# EAGLE design atmega328pTest (EAGLE 9.5.0)
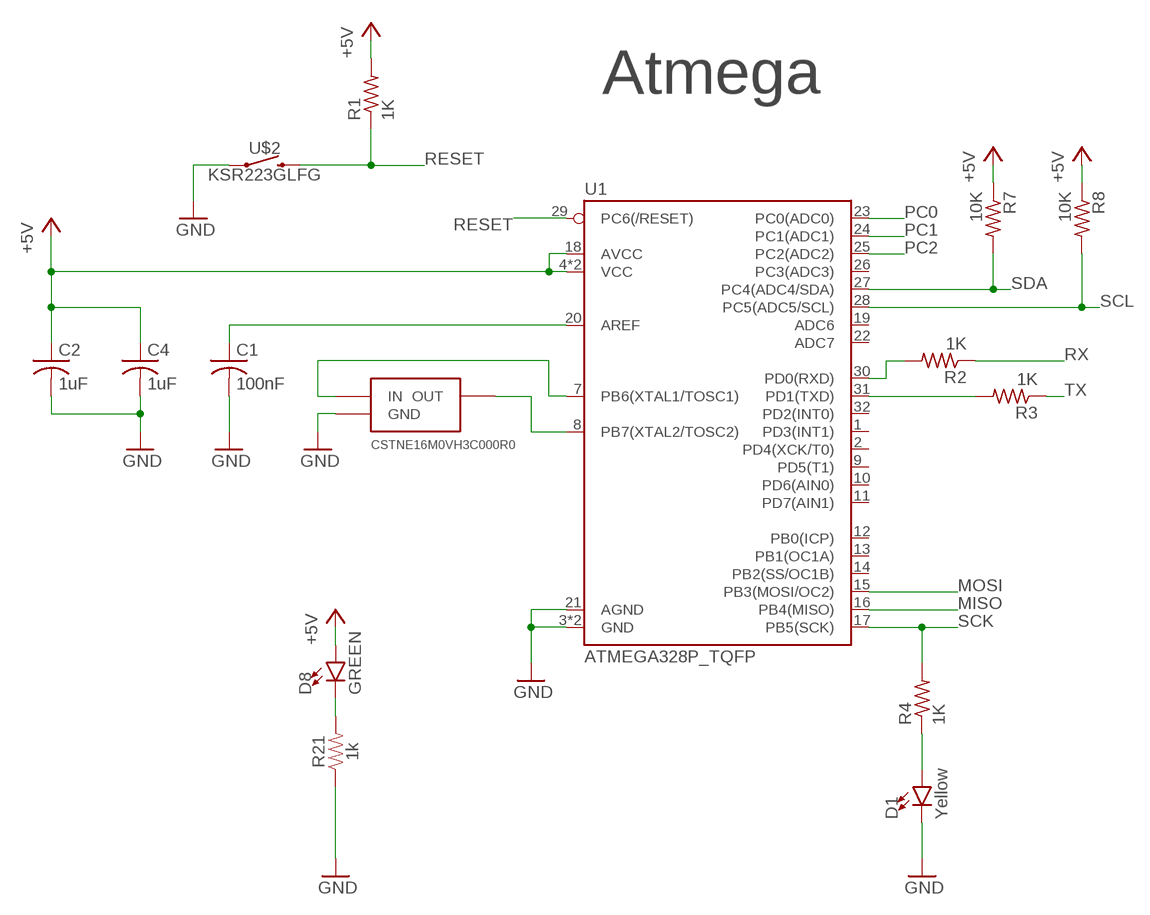
[diagram p0: schematic, sheet 1, part 1 of 2]
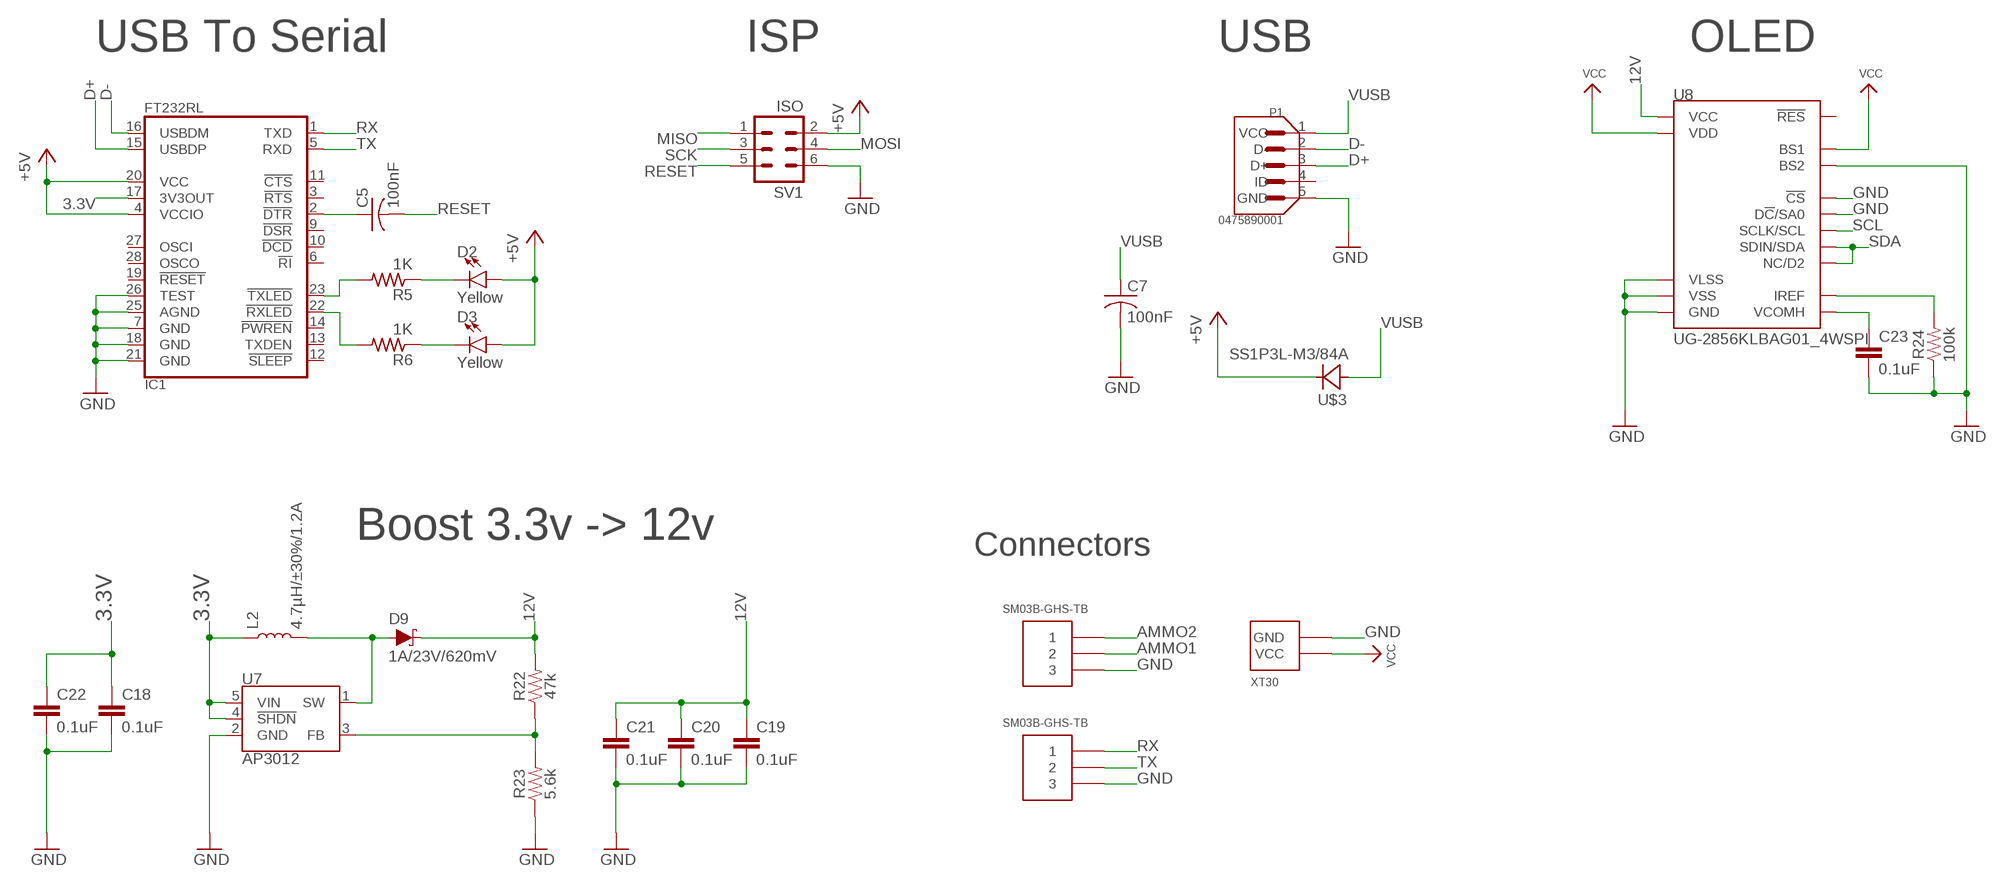
[diagram p1: schematic, sheet 1, part 2 of 2]

## Parts
C1  100nF  C-USC0603  [C0603]
C2  1uF  C-USC0603  [C0603]
C4  1uF  C-USC0603  [C0603]
C5  100nF  C-USC0603  [C0603]
C7  100nF  C-USC0603  [C0603]
C18  0.1uF  0.1UF-0603-25V-(+80/-20%)  [0603]
C19  0.1uF  0.1UF-0603-25V-(+80/-20%)  [0603]
C20  0.1uF  0.1UF-0603-25V-(+80/-20%)  [0603]
C21  0.1uF  0.1UF-0603-25V-(+80/-20%)  [0603]
C22  0.1uF  0.1UF-0603-25V-(+80/-20%)  [0603]
C23  0.1uF  0.1UF-0603-25V-(+80/-20%)  [0603]
D1  Yellow  LED0603  [LED-0603]
D2  Yellow  LED0603  [LED-0603]
D3  Yellow  LED0603  [LED-0603]
D8  GREEN  LED0603  [LED-0603]
D9  1A/23V/620mV  DIODE-SCHOTTKY-BAT20J  [SOD-323]
IC1  FT232RL  [SSOP28-LD]
L2  4.7µH/±30%/1.2A  INDUCTOR-CDRH-4.7UH  [INDUCTOR_4.7UH]
P1  0475890001  [MOLEX_0475890001]
R1  1K  R-US_R0603  [R0603]
R2  1K  R-US_R0603  [R0603]
R3  1K  R-US_R0603  [R0603]
R4  1K  R-US_R0603  [R0603]
R5  1K  R-US_R0603  [R0603]
R6  1K  R-US_R0603  [R0603]
R7  10K  R-US_R0603  [R0603]
R8  10K  R-US_R0603  [R0603]
R21  1k  1KOHM-0603-1/10W-1%  [0603]
R22  47k  47KOHM-0603-1/10W-1%  [0603]
R23  5.6k  5.6KOHM-0603-1/10W-1%  [0603]
R24  100k  100KOHM-0603-1/10W-1%  [0603]
SV1  ISO  MA03-2  [MA03-2]
U1  ATMEGA328P_TQFP  [TQFP32-08]
U7  AP3012  [SOT23-5]
U8  UG-2856KLBAG01_4WSPI  [FPC05024-42201]
U$1  CSTNE16M0VH3C000R0  [CSTNE16M0VH3C000R0]
U$2  KSR223GLFG  [KSR223GLFG]
U$3  SS1P3L-M3/84A  [SS1P3L-M3/84A]
U$13  SM03B-GHS-TB  [SM03B-GHS-TB]
U$14  SM03B-GHS-TB  [SM03B-GHS-TB]
U$15  XT30PW-M  [XT30]

## Nets
3.3V: C18.1 C22.1 IC1.17(3V3OUT) L2.P$1 U7.4(!SHDN!) U7.5(VIN)
12V: C19.1 C20.1 C21.1 D9.C R22.2 U8.P$23(VCC)
+5V: C2.1 C4.1 D2.A D3.A D8.A IC1.4(VCCIO) IC1.20(VCC) R1.2 R7.1 R8.1 SV1.2 U1.4(VCC) U1.6(VCC) U1.18(AVCC) U$3.P$1(C)
AMMO1: U$14.P$4
AMMO2: U$14.P$3
D+: IC1.15(USBDP) P1.3(D+)
D-: IC1.16(USBDM) P1.2(D-)
GND: C1.2 C2.2 C4.2 C7.2 C18.2 C19.2 C20.2 C21.2 C22.2 C23.2 D1.C IC1.7(GND) IC1.18(GND) IC1.21(GND) IC1.25(AGND) IC1.26(TEST) P1.5(GND) R21.1 R23.1 R24.1 SV1.6 U1.3(GND) U1.5(GND) U1.21(AGND) U7.2(GND) U8.P$1(GND) U8.P$2(VLSS) U8.P$3(VSS) U8.P$7(BS2) U8.P$8(!CS) U8.P$10(D!C!/SA0) U8.P$11(GND) U8.P$12(GND) U8.P$16(GND) U8.P$17(GND) U8.P$18(GND) U8.P$19(GND) U8.P$20(GND) U8.P$24(GND) U$1.2(GND) U$2.P$1 U$13.P$5 U$14.P$5 U$15.P$2(GND)
MISO: SV1.1 U1.16(PB4(MISO))
MOSI: SV1.4 U1.15(PB3(MOSI/OC2))
N$1: U1.7(PB6(XTAL1/TOSC1)) U$1.1(IN)
N$2: U1.8(PB7(XTAL2/TOSC2)) U$1.3(OUT)
N$3: D1.A R4.1
N$4: C1.1 U1.20(AREF)
N$5: IC1.23(!TXLED) R5.2
N$6: IC1.22(!RXLED) R6.2
N$7: C5.1 IC1.2(!DTR)
N$8: R2.2 U1.30(PD0(RXD))
N$9: R3.2 U1.31(PD1(TXD))
N$10: D2.C R5.1
N$11: D3.C R6.1
N$27: D8.C R21.2
N$28: D9.A L2.P$2 U7.1(SW)
N$29: R22.1 R23.2 U7.3(FB)
N$30: C23.1 U8.P$22(VCOMH)
N$31: R24.2 U8.P$21(IREF)
PC0: U1.23(PC0(ADC0))
PC1: U1.24(PC1(ADC1))
PC2: U1.25(PC2(ADC2))
RESET: C5.2 R1.1 SV1.5 U1.29(PC6(/RESET)) U$2.P$2
RX: IC1.1(TXD) R2.1 U$13.P$3
SCK: R4.2 SV1.3 U1.17(PB5(SCK))
SCL: R8.2 U1.28(PC5(ADC5/SCL)) U8.P$13(SCLK/SCL)
SDA: R7.2 U1.27(PC4(ADC4/SDA)) U8.P$14(SDIN/SDA) U8.P$15(NC/D2)
TX: IC1.5(RXD) R3.1 U$13.P$4
VCC: U8.P$5(VDD) U8.P$6(BS1) U$15.P$1(VCC)
VUSB: C7.1 P1.1(VCC) U$3.P$2(A)
Unconnected: IC1.3(!RTS) IC1.6(!RI) IC1.9(!DSR) IC1.10(!DCD) IC1.11(!CTS) IC1.12(!SLEEP) IC1.13(TXDEN) IC1.14(!PWREN) IC1.19(!RESET) IC1.27(OSCI) IC1.28(OSCO) P1.4(ID) U1.1(PD3(INT1)) U1.2(PD4(XCK/T0)) U1.9(PD5(T1)) U1.10(PD6(AIN0)) U1.11(PD7(AIN1)) U1.12(PB0(ICP)) U1.13(PB1(OC1A)) U1.14(PB2(SS/OC1B)) U1.19(ADC6) U1.22(ADC7) U1.26(PC3(ADC3)) U1.32(PD2(INT0)) U8.P$9(!RES)

## Notes on the sheet
- Atmega
- USB To Serial | ISP | USB | OLED
- Boost 3.3v -> 12v
- Connectors

## Library data of the parts
C1 C2 C4 C5 C7 = rcl:C-US: CAPACITOR, American symbol; SPICEPREFIX: C
C18-C23 = SparkFun-Capacitors:0.1UF: 0.1µF ceramic capacitors A capacitor is a passive two-terminal electrical component used to store electrical energy temporarily in an electric field.; PROD_ID: CAP-00810
D1-D3 D8 = SparkFun-LED:LED: LED (Generic) Standard schematic elements and footprints for 5mm, 3mm, 1206, and 0603 sized LEDs. Generic LEDs with no color specified.
D9 = SparkFun-DiscreteSemi:DIODE-SCHOTTKY: Schottky diode A Schottky diode is a semiconductor diode which has a low forward voltage drop and a very fast switching action.; PROD_ID: DIO-11623
IC1 = FT232RL:FT232RL; DESCRIPTION: USB Bridge, USB to UART USB 2.0 UART Interface 28-SSOP; DIGI-KEY_PART_NUMBER: 768-1007-1-ND; DIGI-KEY_PURCHASE_URL: https://www.digikey.com/product-detail/en/ftdi-future-technology-devices-international-ltd/FT232RL-REEL/768-1007-1-ND/1836402?utm_source=snapeda&utm_medium=aggregator&utm_campaign=symbol; MF: FTDI, Future; MP: FT232RL; PACKAGE: SSOP-28 FTDI, Future
L2 = SparkFun-Coils:INDUCTOR: Inductors Resist changes in electrical current. Basically a coil of wire. SparkFun Products: SparkFun Load Cell Amplifier - HX711 <https://www.sparkfun.com/products/13879> IOIO-OTG - V2.2 <https://www.sparkfun.com/products/13613>; PROD_ID: NDUC-10146
P1 = 0475890001:0475890001: Conn Micro USB Type AB RCP 5 POS 0.65mm Solder RA SMD 5 Terminal 1 Port T/R; DESCRIPTION: USB - micro AB Receptacle Connector 5 Position Surface Mount, Right Angle; Through Hole; DIGI-KEY_PART_NUMBER: WM17143CT-ND; DIGI-KEY_PURCHASE_URL: https://www.digikey.com/product-detail/en/molex/0475890001/WM17143CT-ND/1832255?utm_source=snapeda&utm_medium=aggregator&utm_campaign=symbol; MF: Molex; MP: 0475890001; PACKAGE: None
R1-R8 = rcl:R-US_: RESISTOR, American symbol; SPICEPREFIX: R
R21 = SparkFun-Resistors:1KOHM: 1kΩ resistor A resistor is a passive two-terminal electrical component that implements electrical resistance as a circuit element. Resistors act to reduce current flow, and, at the same time, act to lower voltage levels within circuits. - Wikipedia; PROD_ID: RES-07856
R22 = SparkFun-Resistors:47KOHM: 47kΩ resistor A resistor is a passive two-terminal electrical component that implements electrical resistance as a circuit element. Resistors act to reduce current flow, and, at the same time, act to lower voltage levels within circuits. - Wikipedia; PROD_ID: RES-07871
R23 = SparkFun-Resistors:5.6KOHM: 5.6kΩ resistor A resistor is a passive two-terminal electrical component that implements electrical resistance as a circuit element. Resistors act to reduce current flow, and, at the same time, act to lower voltage levels within circuits. - Wikipedia; PROD_ID: RES-12378
R24 = SparkFun-Resistors:100KOHM: 100kΩ resistor A resistor is a passive two-terminal electrical component that implements electrical resistance as a circuit element. Resistors act to reduce current flow, and, at the same time, act to lower voltage levels within circuits. - Wikipedia; PROD_ID: RES-07828
SV1 = con-lstb:MA03-2: PIN HEADER; OC_FARNELL: unknown; OC_NEWARK: unknown
U1 = SparkFun-IC-Microcontroller:ATMEGA328P_TQFP: Popular 328P in QFP Storefront component: ATmega328 - TQFP <https://www.sparkfun.com/products/13448> (COM-13448) Datasheet <http://www.sparkfun.com/datasheets/Components/SMD/ATMega328.pdf> SparkFun Products SparkFun RedBoard - Programmed with Arduino <https://www.sparkfun.com/products/12757> (DEV-12757) Arduino Pro Mini 328 - 5V/16MHz <https://www.sparkfun.com/products/11113> (DEV-11113) Arduino Pro Mini 328 - 3.3V/8MHz <https://www.sparkfun.com/products/11114> (DEV-11114) SparkFun OpenLog <https://www.sparkfun.com/products/13712> (DEV-13712) SparkFun MicroView - OLED Arduino Module <https://www.sparkfun.com/products/12923> (DEV-12923) SparkFun Digital Sandbox <https://www.sparkfun.com/products/12651> (DEV-12651) SparkFun PicoBoard <https://www.sparkfun.com/products/11888> (WIG-11888) Arduino Fio <https://www.sparkfun.com/products/10116> (DEV-10116) LilyPad Arduino 328 Main Board <https://www.sparkfun.com/products/13342> (DEV-13342) SparkFun RedStick <https://www.sparkfun.com/products/13741> (DEV-13741) LilyPad MP3 <https://www.sparkfun.com/products/11013> (DEV-11013) LilyPad Arduino SimpleSnap <https://www.sparkfun.com/products/10941> (DEV-10941) SparkFun Stepoko <https://www.sparkfun.com/products/13899> (ROB-13899) SparkFun Geiger Counter <https://www.sparkfun.com/products/11345> (SEN-11345) SparkFun EL Sequencer <https://www.sparkfun.com/products/12781> (COM-12781) Arduino Pro 328 - 5V/16MHz <https://www.sparkfun.com/products/10915> (DEV-10915) CryptoCape <https://www.sparkfun.com/products/12773> (DEV-12773) SparkFun IR Thermometer Evaluation Board - MLX90614 <https://www.sparkfun.com/products/10740> (SEN-10740) SparkFun RedBot Mainboard <https://www.sparkfun.com/products/12097> (ROB-12097) Arduino Pro 328 - 3.3V/8MHz <https://www.sparkfun.com/products/10914> (DEV-10914) SparkFun Block for Intel® Edison - Arduino <https://www.sparkfun.com/products/13036> (DEV-13036) SparkFun Simon Says - Surface Mount Soldering Kit <https://www.sparkfun.com/products/10935> (KIT-10935) SparkFun 7-Segment Serial Display - Red <https://www.sparkfun.com/products/11441> (COM-11441) SparkFun 7-Segment Serial Display - White <https://www.sparkfun.com/products/11629> (COM-11629) SparkFun 7-Segment Serial Display - Yellow <https://www.sparkfun.com/products/11443> (COM-11443) SparkFun 7-Segment Serial Display - Kelly Green <https://www.sparkfun.com/products/11440> (COM-11440) SparkFun 7-Segment Serial Display - Blue <https://www.sparkfun.com/products/11442> (COM-11442) SparkFun OpenSegment Serial Display - 20mm (Blue) <https://www.sparkfun.com/products/11647> (COM-11647) SparkFun OpenSegment Serial Display - 20mm (Green) <https://www.sparkfun.com/products/11646> (COM-11646) SparkFun OpenSegment Serial Display - 20mm (White) <https://www.sparkfun.com/products/11648> (COM-11648) SparkFun OpenSegment Serial Display - 20mm (Red) <https://www.sparkfun.com/products/11644> (COM-11644) SparkFun OpenSegment Serial Display - 20mm (Yellow) <https://www.sparkfun.com/products/11645> (COM-11645) SparkFun OpenSegment Shield <https://www.sparkfun.com/products/13190> (DEV-13190); PROD_ID: IC-09069
U7 = SparkFun-IC-Power:AP3012: AP3012 The AP3012 is a high power, constant frequency, current mode PWM, inductor based, step-up (boost) converter. The converter operates at high frequency (1.5MHz) so that a small, low profile inductor can be used. Datasheet <https://www.diodes.com/assets/Datasheets/AP3012.pdf>; PROD_ID: VREG-13911
U8 = SparkFun-Displays:UG-2856KLBAG01_4WSPI; PROD_ID: CONN-14195
U$1 = HenrySilva:CSTNE16M0VH3C000R0
U$2 = HenrySilva:KSR223GLFG
U$3 = HenrySilva:SS1P3L-M3/84A
U$13 U$14 = oledBoard:SM03B-GHS-TB
U$15 = oledBoard:XT30PW-M

## Board
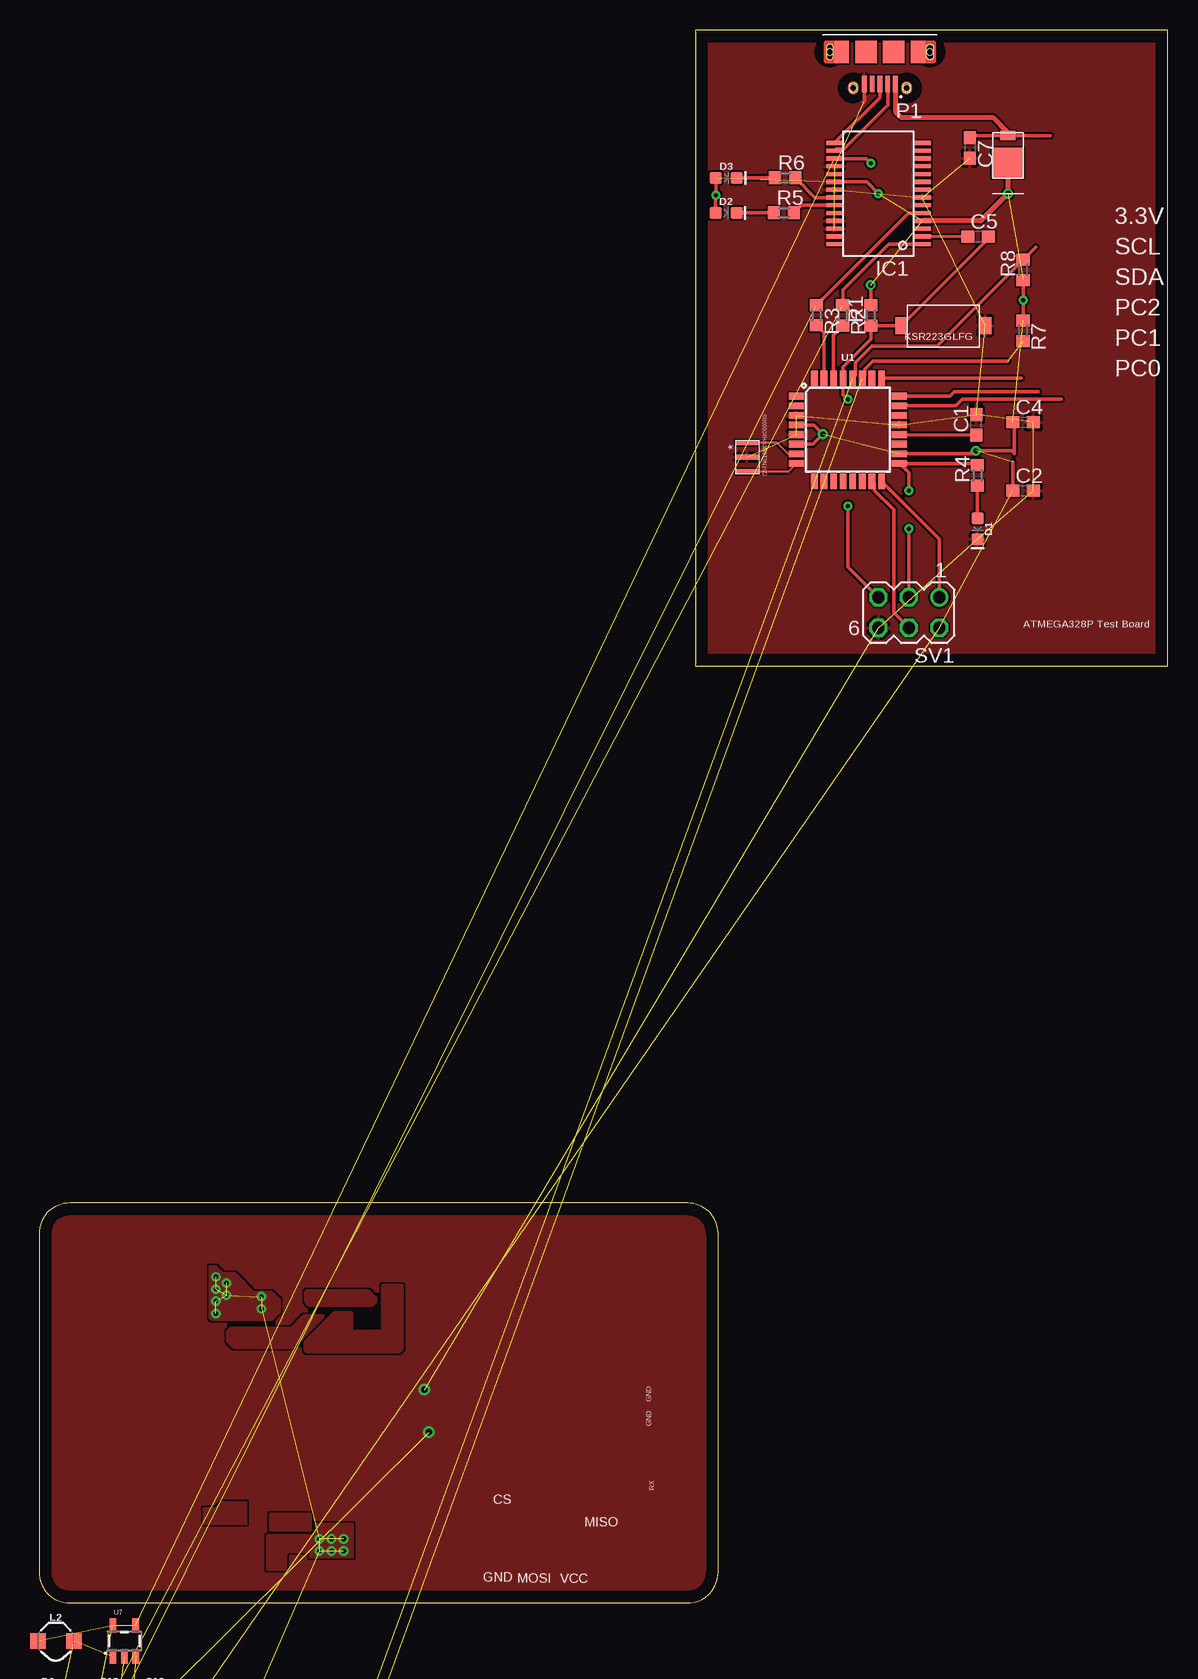
[diagram p2: board, top side]
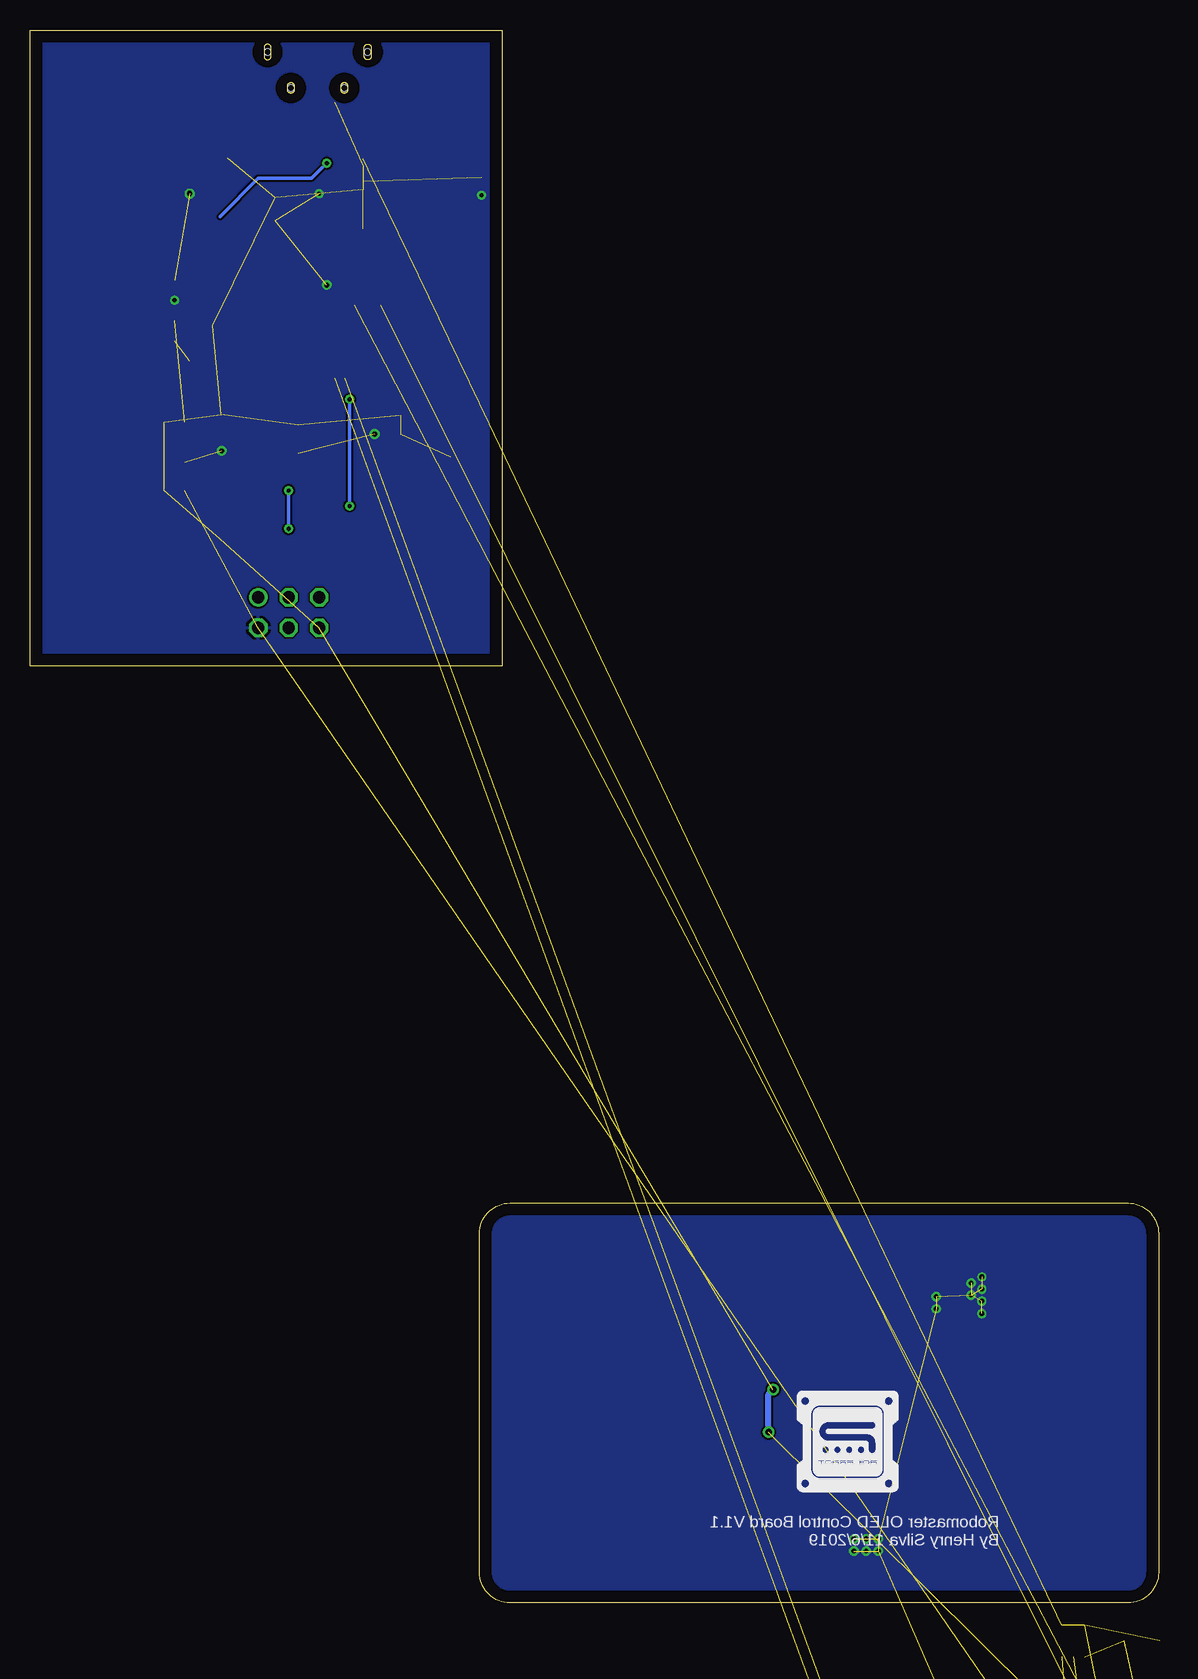
[diagram p3: board, bottom side, seen from below]

Size 94.09 x 131.12 mm. Coordinates in mm from the lower left corner, seen from the top.
Outline: 54.74,78.1 94.09,78.1 94.09,131.12 54.74,131.12 54.74,78.1
Outline: 54.08,33.32 2.54,33.32 arc90 0,30.78 0,2.54 arc90 2.54,0 54.08,0 arc90 56.62,2.54 56.62,30.78 arc90 54.08,33.32
Copper layers (1*16): Top 0.035mm / dielectric 1.5mm / Bottom 0.035mm
Design rules "default": minimum track width 6mil, minimum drill 0.35mm, track to track 6mil, track to pad 6mil, pad to pad 6mil, via to via 6mil, smd to smd 6mil, copper to edge 40mil, drill to drill 6mil, minimum pad ring 10mil, minimum via ring 8mil, stop-mask expansion 4mil, vias tented up to drill 0mil, thermal gap 10mil

### Footprints (pad centres in the part's own frame; a part is rotated, then mirrored left to right if it is on the bottom)
C0603 = smd 1.1 x 1: 1 -0.85,0; 2 0.85,0
0603 = smd 1.1 x 1: 1 -0.85,0; 2 0.85,0
LED-0603 = smd 1 x 1: A -0.877,0; C 0.877,0
SOD-323 = smd 0.63 x 0.83: A 1.15,0; C -1.15,0
SSOP28-LD = smd 0.348 x 1.397: 1 -4.225,-3.656; 2 -3.575,-3.656; 3 -2.925,-3.656; 4 -2.275,-3.656; 5 -1.625,-3.656; 6 -0.975,-3.656; 7 -0.325,-3.656; 8 0.325,-3.656; 9 0.975,-3.656; 10 1.625,-3.656; 11 2.275,-3.656; 12 2.925,-3.656; 13 3.575,-3.656; 14 4.225,-3.656; 15 4.225,3.656; 16 3.575,3.656; 17 2.925,3.656; 18 2.275,3.656; 19 1.625,3.656; 20 0.975,3.656; 21 0.325,3.656; 22 -0.325,3.656; 23 -0.975,3.656; 24 -1.625,3.656; 25 -2.275,3.656; 26 -2.925,3.656; 27 -3.575,3.656; 28 -4.225,3.656
INDUCTOR_4.7UH = smd 1.3 x 1.3: P$1 -1.5,0; P$2 1.5,0
MOLEX_0475890001 = smd 0.4 x 1.35: 1 -1.3,2.675; 2 -0.65,2.675; 3 0,2.675; 4 0.65,2.675; 5 1.3,2.675 | smd 1.175 x 1.9: 6 -3.187,0; 9 3.187,0 | smd 1.8 x 1.9: 7 -1.15,0; 8 1.15,0 | hole 0.5: -2.225,3; 2.225,3; -4.175,0; 4.175,0
R0603 = smd 1 x 1.1: 1 -0.85,0; 2 0.85,0
MA03-2 = drill 1.016: 1 -2.54,-1.27 | drill 1.016 octagon: 2 -2.54,1.27; 3 0,-1.27; 4 0,1.27; 5 2.54,-1.27; 6 2.54,1.27
TQFP32-08 = smd 1.27 x 0.559: 1 -4.293,2.8; 2 -4.293,2; 3 -4.293,1.2; 4 -4.293,0.4; 5 -4.293,-0.4; 6 -4.293,-1.2; 7 -4.293,-2; 8 -4.293,-2.8; 17 4.293,-2.8; 18 4.293,-2; 19 4.293,-1.2; 20 4.293,-0.4; 21 4.293,0.4; 22 4.293,1.2; 23 4.293,2; 24 4.293,2.8 | smd 0.559 x 1.27: 9 -2.8,-4.293; 10 -2,-4.293; 11 -1.2,-4.293; 12 -0.4,-4.293; 13 0.4,-4.293; 14 1.2,-4.293; 15 2,-4.293; 16 2.8,-4.293; 25 2.8,4.293; 26 2,4.293; 27 1.2,4.293; 28 0.4,4.293; 29 -0.4,4.293; 30 -1.2,4.293; 31 -2,4.293; 32 -2.8,4.293
SOT23-5 = smd 0.55 x 1.2: 1 -0.95,-1.3; 2 0,-1.3; 3 0.95,-1.3; 4 0.95,1.3; 5 -0.95,1.3
FPC05024-42201 = smd 0.3 x 0.8: P$1 -5.75,0.4; P$2 -5.25,0.4; P$3 -4.75,0.4; P$4 -4.25,0.4; P$5 -3.75,0.4; P$6 -3.25,0.4; P$7 -2.75,0.4; P$8 -2.25,0.4; P$9 -1.75,0.4; P$10 -1.25,0.4; P$11 -0.75,0.4; P$12 -0.25,0.4; P$13 0.25,0.4; P$14 0.75,0.4; P$15 1.25,0.4; P$16 1.75,0.4; P$17 2.25,0.4; P$18 2.75,0.4; P$19 3.25,0.4; P$20 3.75,0.4; P$21 4.25,0.4; P$22 4.75,0.4; P$23 5.25,0.4; P$24 5.75,0.4
CSTNE16M0VH3C000R0 = smd 0.4 x 1.9: 1 2.6,1; 2 1.4,1; 3 0.2,1
KSR223GLFG = smd 1 x 1.4: P$1 0.5,0.7; P$2 7.5,0.7
SS1P3L-M3/84A = smd 2.54 x 2.667: P$1 1.27,1.27 | smd 0.762 x 1.27: P$2 3.574,1.275
SM03B-GHS-TB = smd 1 x 2.7: P$1 0.5,1.35; P$2 6.7,1.35 | smd 0.6 x 1.7: P$3 2.35,4.55; P$4 3.6,4.55; P$5 4.85,4.55
XT30 = drill 1.7: P$1 0,0; P$2 5,0 | drill 1: P$3 -3,10; P$4 8,10

### Placement (x,y rotation side)
C1  78.13,98.2 90 top
C2  82.04,92.71 0 top
C4  82.04,98.42 0 top
C5  78.28,113.89 0 top
C7  77.6,121.28 270 top
C18  5.84,-7.62 0 top  (outside the outline)
C19  9.65,-7.62 0 top  (outside the outline)
C20  -1.14,-11.43 0 top  (outside the outline)
C21  2.67,-11.43 0 top  (outside the outline)
C22  6.48,-11.43 0 top  (outside the outline)
C23  -1.14,-69.85 0 top  (outside the outline)
D1  78.23,89.53 270 top
D2  57.28,115.87 0 top
D3  57.3,118.8 0 top
D8  9.65,-14.61 0 top  (outside the outline)
D9  0.76,-7.62 0 top  (outside the outline)
IC1  69.98,117.47 90 top
L2  1.4,-3.18 0 top  (outside the outline)
P1  70.1,129.29 180 top
R1  69.34,107.31 90 top
R2  67.01,107.31 270 top
R3  64.82,107.34 270 top
R4  78.23,93.98 90 top
R5  62.1,115.87 0 top
R6  62.2,118.8 0 top
R7  82.04,106.04 270 top
R8  82.04,111.12 90 top
R21  -1.14,-15.24 0 top  (outside the outline)
R22  2.67,-15.24 0 top  (outside the outline)
R23  6.48,-15.24 0 top  (outside the outline)
R24  2.67,-69.85 0 top  (outside the outline)
SV1  72.52,82.55 180 top
U1  67.44,97.79 0 top
U7  7.11,-3.18 0 top
U8  8.38,-60.32 0 top  (outside the outline)
U$1  60.02,94.11 90 top
U$2  79.38,107.16 180 top
U$3  82.04,118.75 90 top
U$13  -1.78,-22.86 0 top  (outside the outline)
U$14  -1.78,-29.85 0 top  (outside the outline)
U$15  1.4,-46.35 0 top  (outside the outline)

### Tracks (layer width: path | path; a pad name or v marks a point on that pad's centre or on a via)
3.3V  (via drill 0.35)  (5 unrouted)
  Top 0.305: IC1.17 68.96,120.4 v69.34,120.01
  Bottom 0.305: v69.34,120.01 70.61,118.75 75.06,118.75 78.23,115.57
5V
  pour Top (no thermals): 17.27,6.6 13.72,6.6 13.72,7.87 14.73,7.87 15.24,8.38 17.27,8.38
12V  (5 unrouted)
  pour Top: 24.64,24.13 22.23,21.72 22.23,21.08 22.35,20.95 29.97,20.95 30.23,21.21 30.23,26.42 28.7,26.42 28.7,22.73 28.57,22.61 26.42,22.61 26.29,22.48 26.04,22.73 26.04,24.13
+5V  (via drill 0.35, 0.4, 0.45)  (9 unrouted)
  Top 0.305: U1.18 77.86,95.79 v78.11,96.04 81.1,96.04 81.33,95.81 81.33,98.29 C4.1 | C2.1 81.19,95.11 | U1.6 64.51,96.59 v65.35,97.43 64.6,98.19 U1.4 | R1.2 v69.34,109.85 | v69.98,117.47 69,118.45 IC1.20 | D3.A 56.42,117.36 | 56.42,117.36 v56.44,117.35 | D2.A 56.4,117.34 56.42,117.36 | R8.1 v82.04,108.59 R7.1
  Top 0.406: U$3.P$1 v80.77,117.47 78.5,115.2 IC1.4
  pour Bottom: 11.56,139.7 11.56,38.1 175.39,38.1 175.39,140.34 11.56,140.34
D+
  Top 0.305: P1.3 70.1,125.48 IC1.15
D-
  Top 0.305: IC1.16 66.49,121.22 67.15,121.22 70.75,124.83 P1.2
GND  (via drill 0.55)  (44 unrouted)
  Top 0.305: P1.5 68.8,125.19 68.71,125.09
  Bottom 0.508: v32.51,14.22 32.51,17.4 v32.13,17.78
  pour Top: 12.83,38.73 12.83,142.24 174.12,142.24 174.75,141.6 174.75,38.1 12.83,38.1
  pour Top (rank 2): -2.41,0.63 57.28,0.63 57.28,34.29 -2.41,34.29
MISO
  Top 0.305: U1.16 75.06,88.68 SV1.1
MOSI
  Top 0.305: SV1.4 71.25,82.55 71.25,91.14 69.65,92.74 69.65,93.28 U1.15
N$1
  Top 0.203: U$1.1 61.53,96.71 62.45,95.79 U1.7
N$2
  Top 0.203: U$1.3 62.46,94.31 U1.8
N$3
  Top 0.305: R4.1 D1.A
N$4
  Top 0.254: U1.20 78.09,97.39 C1.1
N$5
  Top 0.305: IC1.23 63.58,116.5 R5.2
N$6
  Top 0.305: IC1.22 64.7,117.15 R6.2
N$7
  Top 0.254: C5.1 IC1.2
N$8
  Top 0.305: R2.2 66.24,105.7 U1.30
N$9
  Top 0.305: R3.2 65.44,105.87 U1.31
N$10
  Top 0.305: R5.1 D2.C
N$11
  Top 0.305: R6.1 D3.C
N$13
  pour Top (no thermals): 16,22.86 21.08,22.86 22.1,23.88 23.62,23.88 21.08,21.34 16.26,21.34 15.75,21.84 15.75,22.61
N$14
  pour Top (no thermals): 22.35,25.91 27.43,25.91 27.94,25.4 27.94,25.15 27.69,24.89 22.61,24.89 22.35,25.15
N$26
  pour Top (no thermals): 19.3,6.1 22.61,6.1 22.61,7.37 19.3,7.37
N$27  (1 unrouted)
N$28  (2 unrouted)
N$29  (2 unrouted)
N$30  (1 unrouted)
N$31  (1 unrouted)
PC0
  Top 0.305: U1.23 76.42,99.79 76.96,100.33 85.22,100.33
PC1
  Top 0.305: U1.24 75.95,100.59 76.33,100.97 83.31,100.97
PC2
  Top 0.305: U1.25 81.89,102.08
RESET  (via drill 0.35)
  Top 0.305: C5.2 79.13,113.72 U$2.P$2 R1.1 69.34,105.33 67.04,103.03 U1.29 67.04,100.73 v67.44,100.33 | SV1.5 67.44,86.36 v67.44,91.44
  Bottom 0.305: v67.44,91.44 v67.44,100.33
RX  (1 unrouted)
  Top 0.305: IC1.1 70.83,113.25 67,109.42 R2.1
SCK  (via drill 0.35)
  Top 0.305: R4.2 78.07,94.99 U1.17 72.52,94.2 v72.52,92.71 | SV1.3 v72.52,89.53
  Bottom 0.305: v72.52,89.53 v72.52,92.71
SCL  (1 unrouted)
  Top 0.305: U1.28 68.05,102.3 68.05,103.4 69.43,104.78 74.84,104.78 R8.2 83.1,113.03
SDA  (3 unrouted)
  Top 0.305: U1.27 68.85,102.3 68.85,102.84 69.51,103.5 80.77,103.5
TX  (1 unrouted)
  Top 0.305: R3.1 72.48,115.85 IC1.5
VCC  (via drill 0.38, 0.4)  (16 unrouted)
  other vias: 18.54,25.53 18.54,24.51 14.73,27.18 14.73,26.16 14.73,25.15 14.73,24.13 15.62,26.67 15.62,25.65 23.37,5.33 24.38,5.33 24.38,4.32 23.37,4.32 25.4,4.32 25.4,5.33
  pour Bottom: -1.78,1.27 57.91,1.27 57.91,34.29 -1.78,34.29
  pour Top (no thermals): 14.48,27.94 14.48,23.88 19.3,23.88 19.81,24.38 19.81,25.15 19.3,25.65 17.78,25.65 16.26,27.18 14.99,27.18 14.99,27.43
  pour Top (no thermals): 19.05,5.59 24.64,5.59 24.64,4.32 20.83,4.32 20.57,4.06 20.57,2.79 19.05,2.79
  pour Top (no thermals): 22.61,3.81 26.16,3.81 26.16,6.6 23.11,6.6 23.11,5.84 22.61,5.33
VUSB
  Top 0.305: C7.1 77.78,122.32 U$3.P$2 84.31,122.32
  Top 0.406: P1.1 71.4,124.3 71.88,123.82 79.5,123.82 80.77,122.56 U$3.P$2

### Text on the board
tPlace: 3.3V | SCL | SDA | PC2 | PC1 | PC0 | ATMEGA328P Test Board
tNames: GND | GND | RX | CS | MISO | GND | MOSI | VCC
bNames: Robomaster OLED Control Board V1.1 / By Henry Silva 11/6/2019